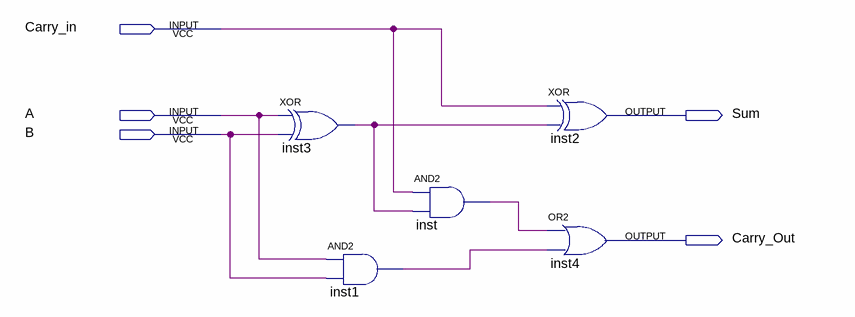
[diagram p0: schematic sheet]
// Quartus schematic lab4_prelab.bdf as structural Verilog: 5 symbols, 5 pins
module lab4_prelab (
  input  Carry_in,
  input  A,
  input  B,
  output Sum,
  output Carry_Out
);

  wire inst1_out, inst3_out, inst_out;

  xor inst3 (inst3_out, A, B);
  and inst1 (inst1_out, A, B);
  and inst (inst_out, Carry_in, inst3_out);
  xor inst2 (Sum, Carry_in, inst3_out);
  or inst4 (Carry_Out, inst_out, inst1_out);
endmodule
